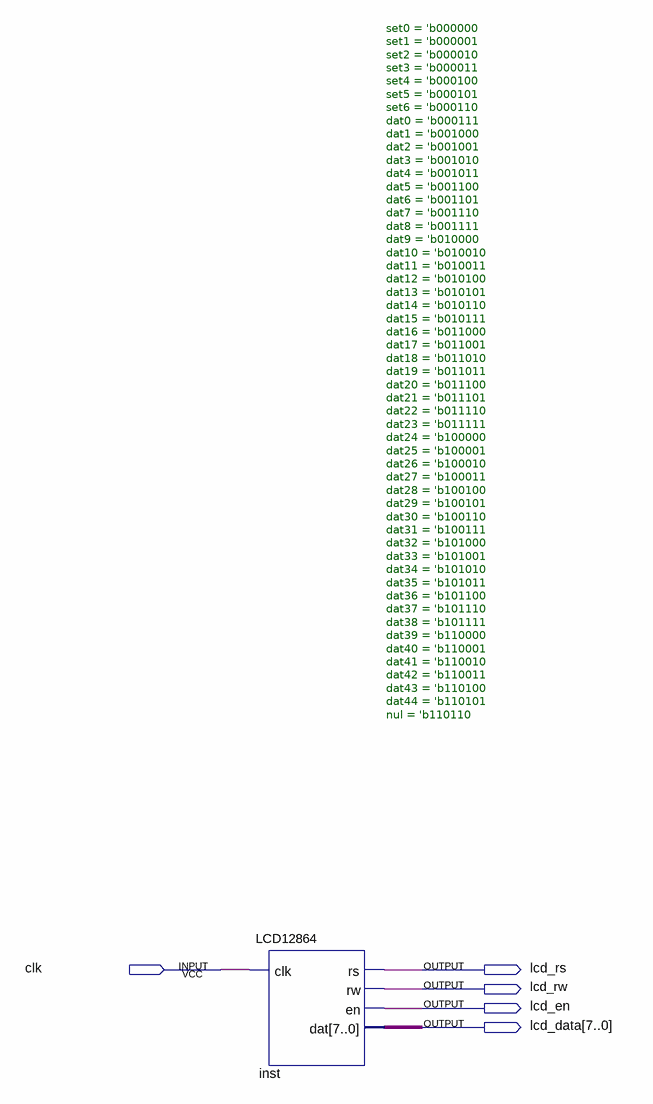
[diagram p0: schematic sheet]
// Quartus schematic LCD12864_TOP.bdf as structural Verilog: 1 symbols, 5 pins
module LCD12864_TOP (
  input  clk,
  output lcd_rs,
  output lcd_rw,
  output lcd_en,
  output [7:0] lcd_data
);

  LCD12864 #(.set0('b000000), .set1('b000001), .set2('b000010), .set3('b000011), .set4('b000100), .set5('b000101), .set6('b000110), .dat0('b000111), .dat1('b001000), .dat2('b001001), .dat3('b001010), .dat4('b001011), .dat5('b001100), .dat6('b001101), .dat7('b001110), .dat8('b001111), .dat9('b010000), .dat10('b010010), .dat11('b010011), .dat12('b010100), .dat13('b010101), .dat14('b010110), .dat15('b010111), .dat16('b011000), .dat17('b011001), .dat18('b011010), .dat19('b011011), .dat20('b011100), .dat21('b011101), .dat22('b011110), .dat23('b011111), .dat24('b100000), .dat25('b100001), .dat26('b100010), .dat27('b100011), .dat28('b100100), .dat29('b100101), .dat30('b100110), .dat31('b100111), .dat32('b101000), .dat33('b101001), .dat34('b101010), .dat35('b101011), .dat36('b101100), .dat37('b101110), .dat38('b101111), .dat39('b110000), .dat40('b110001), .dat41('b110010), .dat42('b110011), .dat43('b110100), .dat44('b110101), .nul('b110110)) inst (
    .clk(clk), .rs(lcd_rs), .rw(lcd_rw), .en(lcd_en), .dat(lcd_data));
endmodule
